# EAGLE schematic coil-control-module-v4 (EAGLE 7.1.0)
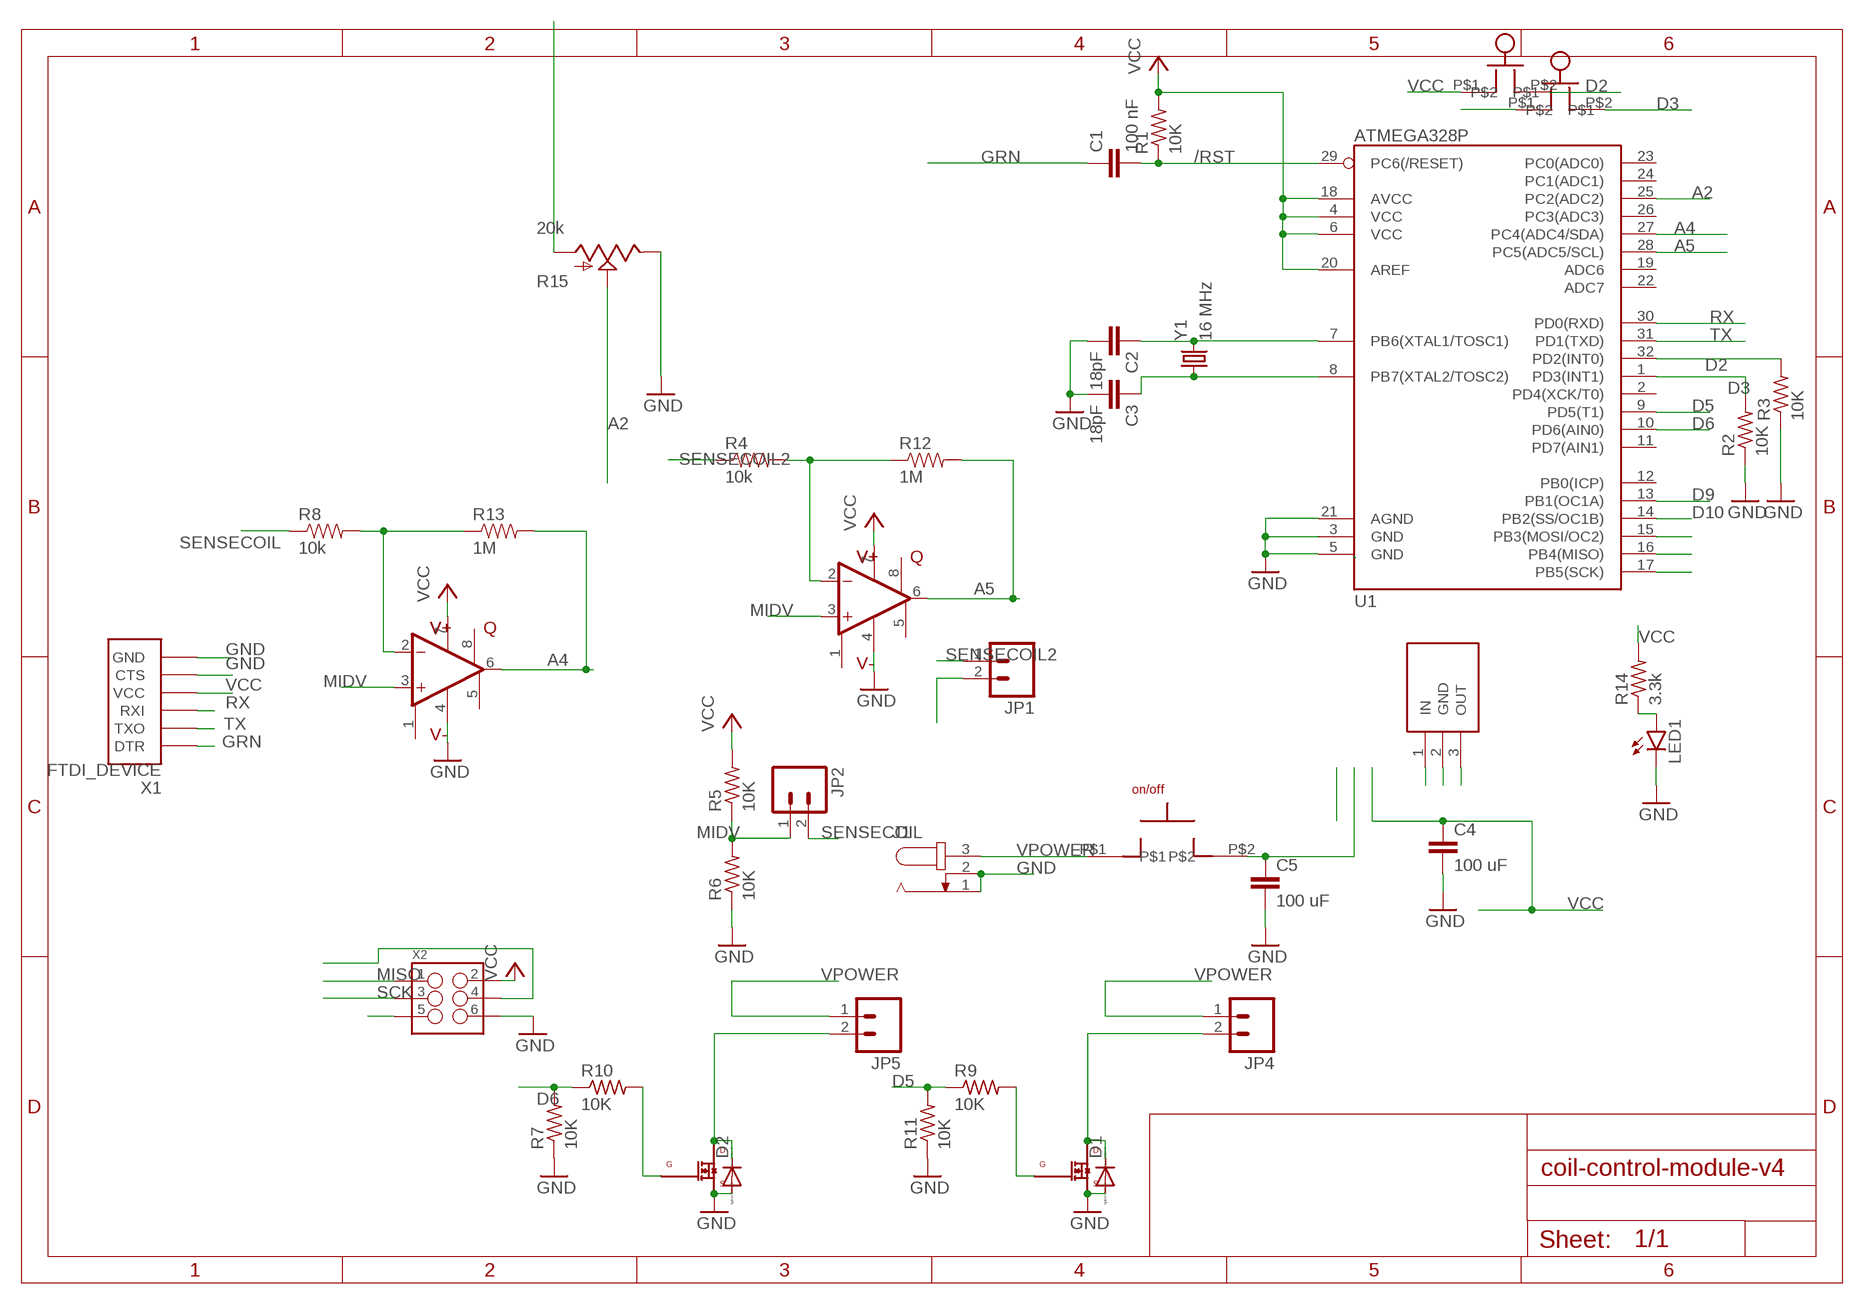
[diagram p0: schematic, sheet 1]

## Parts
C1  100 nF  CAP0603-CAP  [0603-CAP]
C2  18pF  C-EUC0603  [C0603]
C3  18pF  C-EUC0603  [C0603]
C4  100 uF  CAP1206  [1206]
C5  100 uF  CAP1206  [1206]
D1  DIODE-DO-214AC  [DO-214AC]
D2  DIODE-DO-214AC  [DO-214AC]
J1  JACK-PLUG1  [SPC4078]
JP1  M02PTH  [1X02]
JP2  M02PTH  [1X02]
JP4  M02PTH  [1X02]
JP5  M02PTH  [1X02]
LED1  LED-3MM-NO_SILK  [LED3MM-NS]
Q1  IRLML0060  [SOT-23]
Q2  IRLML0060  [SOT-23]
R1  10K  R-US_R0603  [R0603]
R2  10K  R-US_R0603  [R0603]
R3  10K  R-US_R0603  [R0603]
R4  10k  RESISTOR0603  [0603-RES]
R5  10K  R-US_R0603  [R0603]
R6  10K  R-US_R0603  [R0603]
R7  10K  R-US_R0603  [R0603]
R8  10k  RESISTOR0603  [0603-RES]
R9  10K  R-US_R0603  [R0603]
R10  10K  R-US_R0603  [R0603]
R11  10K  R-US_R0603  [R0603]
R12  1M  RESISTOR0805-RES  [0805]
R13  1M  RESISTOR0805-RES  [0805]
R14  3.3k  R-US_R0603  [R0603]
R15  20k  POTALPS-KIT  [ALPS_POT_KIT]
SW1  CW182-ND  [CW182-ND]
SW2  BUTTON  [BUTTON]
SW3  BUTTON  [BUTTON]
U1  ATMEGA328P  ATMEGA328_SMT  [TQFP32-08]
U2  LM4250  [DIP08]
U3  LM4250  [DIP08]
U5  L78L33ABZ-AP  [TO92-3]
X1  FTDI_DEVICE  [FTDI_DEVICE_SIDE]
X2  M03X2NO_SILK  [2X3-NS]
Y1  16 MHz  CRYSTAL5X3  [CRYSTAL-SMD-5X3]

## Nets
/RST: C1.2 R1.1 U1.29(PC6(/RESET)) X2.5
A2: R15.P$2(S) U1.25(PC2(ADC2))
A4: R13.2 U1.27(PC4(ADC4/SDA)) U2.6(OUT)
A5: R12.2 U1.28(PC5(ADC5/SCL)) U3.6(OUT)
D2: R3.2 SW2.P$2 U1.32(PD2(INT0))
D3: R2.2 SW3.P$2 U1.1(PD3(INT1))
D5: R9.1 R11.2 U1.9(PD5(T1))
D6: R7.2 R10.1 U1.10(PD6(AIN0))
D9: U1.13(PB1(OC1A))
D10: U1.14(PB2(SS/OC1B))
GND: C2.2 C3.2 C4.2 C5.2 D1.A D2.A J1.1 J1.2 LED1.K(C) Q1.2(SOURCE) Q2.2(SOURCE) R2.1 R3.1 R6.1 R7.1 R11.1 R15.P$1(E) U1.3(GND) U1.5(GND) U1.21(AGND) U2.4(V-) U3.4(V-) U5.2(GND) X1.P$5(CTS) X1.P$6(GND) X2.6
GRN: C1.1 X1.P$1(DTR)
MIDV: JP1.2 JP2.1 R5.1 R6.2 U2.3(+IN) U3.3(+IN)
MISO: U1.16(PB4(MISO)) X2.1
MOSI: U1.15(PB3(MOSI/OC2)) X2.4
N$3: R4.2 R12.1 U3.2(-IN)
N$4: C2.1 U1.7(PB6(XTAL1/TOSC1)) Y1.3
N$10: LED1.A R14.1
N$11: C3.1 U1.8(PB7(XTAL2/TOSC2)) Y1.1
N$13: Q1.1(GATE) R9.2
N$14: R8.2 R13.1 U2.2(-IN)
N$15: D1.C JP4.2 Q1.3(DRAIN)
N$17: Q2.1(GATE) R10.2
N$18: D2.C JP5.2 Q2.3(DRAIN)
RX: U1.30(PD0(RXD)) X1.P$3(RXI)
SCK: U1.17(PB5(SCK)) X2.3
SENSECOIL: JP2.2 R8.1
SENSECOIL2: JP1.1 R4.1
TX: U1.31(PD1(TXD)) X1.P$2(TXO)
VCC: C4.1 R1.2 R5.2 R14.2 R15.P$3(A) SW2.P$1 SW3.P$1 U1.4(VCC) U1.6(VCC) U1.18(AVCC) U1.20(AREF) U2.7(V+) U3.7(V+) U5.3(OUT) X1.P$4(VCC) X2.2
VIN: C5.1 SW1.P$2 U5.1(IN)
VPOWER: J1.3 JP4.1 JP5.1 SW1.P$1
Unconnected: U1.2(PD4(XCK/T0)) U1.11(PD7(AIN1)) U1.12(PB0(ICP)) U1.19(ADC6) U1.22(ADC7) U1.23(PC0(ADC0)) U1.24(PC1(ADC1)) U1.26(PC3(ADC3)) U2.1(NULL1) U2.5(NULL2) U2.8(QUIES) U3.1(NULL1) U3.5(NULL2) U3.8(QUIES)

## Library data of the parts
C1 = SparkFun-Passives:CAP: Capacitor Standard 0603 ceramic capacitor, and 0.1" leaded capacitor.
C2 C3 = resistor:C-EU: CAPACITOR, European symbol
C4 C5 = SparkFun-Capacitors:CAP: Capacitor Standard 0603 ceramic capacitor, and 0.1" leaded capacitor.
D1 D2 = diode:DIODE-: DIODE
J1 = con-jack:JACK-PLUG: DC POWER JACK Power Jack, DC, Right Angle, Through Hole, Rated 5A at 16VDC, PC Terminals Distributor: Farnell (www.Farnell.de) Drawing: 84N1161.pdf / 84N1162.pdf Manufacturer: SPC Technology (www.spctechnology.com) Type: SPC4077 / SPC 4078; OC_FARNELL: unknown; OC_NEWARK: unknown
JP1 JP2 JP4 JP5 = SparkFun-Connectors:M02: Standard 2-pin 0.1" header. Use with - straight break away headers ( PRT-00116) - right angle break away headers (PRT-00553) - swiss pins (PRT-00743) - machine pins (PRT-00117) - female headers (PRT-00115) Molex polarized connector foot print use with: PRT-08233 with associated crimp pins and housings. 2.54_SCREWTERM for use with PRT-10571. 3.5mm Screw Terminal footprints for PRT-08084 5mm Screw Terminal footprints for use with PRT-08432
LED1 = SparkFun-LED:LED: LEDs Standard schematic elements and footprints for 5mm, 3mm, 1206, and 0603 sized LEDs. 5mm - Spark Fun Electronics SKU : COM-00529 (and others)
Q1 Q2 = spietz-library:IRLML0060
R1-R3 R5-R7 R9-R11 R14 = resistor:R-US_: RESISTOR, American symbol
R4 R8 = SparkFun-Resistors:RESISTOR: Resistor Basic schematic elements and footprints for 0603, 1206, and PTH resistors.
R12 R13 = SparkFun-Passives:RESISTOR: Resistor Basic schematic elements and footprints for 0603, 1206, and PTH resistors.
R15 = SparkFun-Electromechanical:POT
SW1 = spietz-library:CW182-ND
SW2 SW3 = spietz-library:BUTTON
U1 = SparkFun-DigitalIC:ATMEGA328_SMT: 32-Pin Atmega328 part Commonly used on Arduino compatible boards Available in QFP and QFN packages TQFP is IC-09069 QFN is non-stock; PROD_ID: IC-09069
U2 U3 = spietz-library:LM4250
U5 = spietz-library:L78L33ABZ-AP
X1 = SparkFun-Connectors:FTDI_DEVICE: Connector which mates to FTDI basic or FTDI cable.
X2 = SparkFun-Connectors:M03X2: 2x3 .1" header. Shrouded, with keying- CONN-10681 SMT- CONN-11415 Pogo pins- HW-11044
Y1 = SparkFun-FreqCtrl:CRYSTAL: Various standard crystals. Proven footprints. Spark Fun Electronics SKU : COM-00534

## Net classes
0 default: width 0.203 mm
1 vcc: width 0.254 mm